# Altium schematic sheet TSE_switching_boardE3.SchDoc
size 420 x 297 mm; SheetNumber: 1; SheetTotal: 2
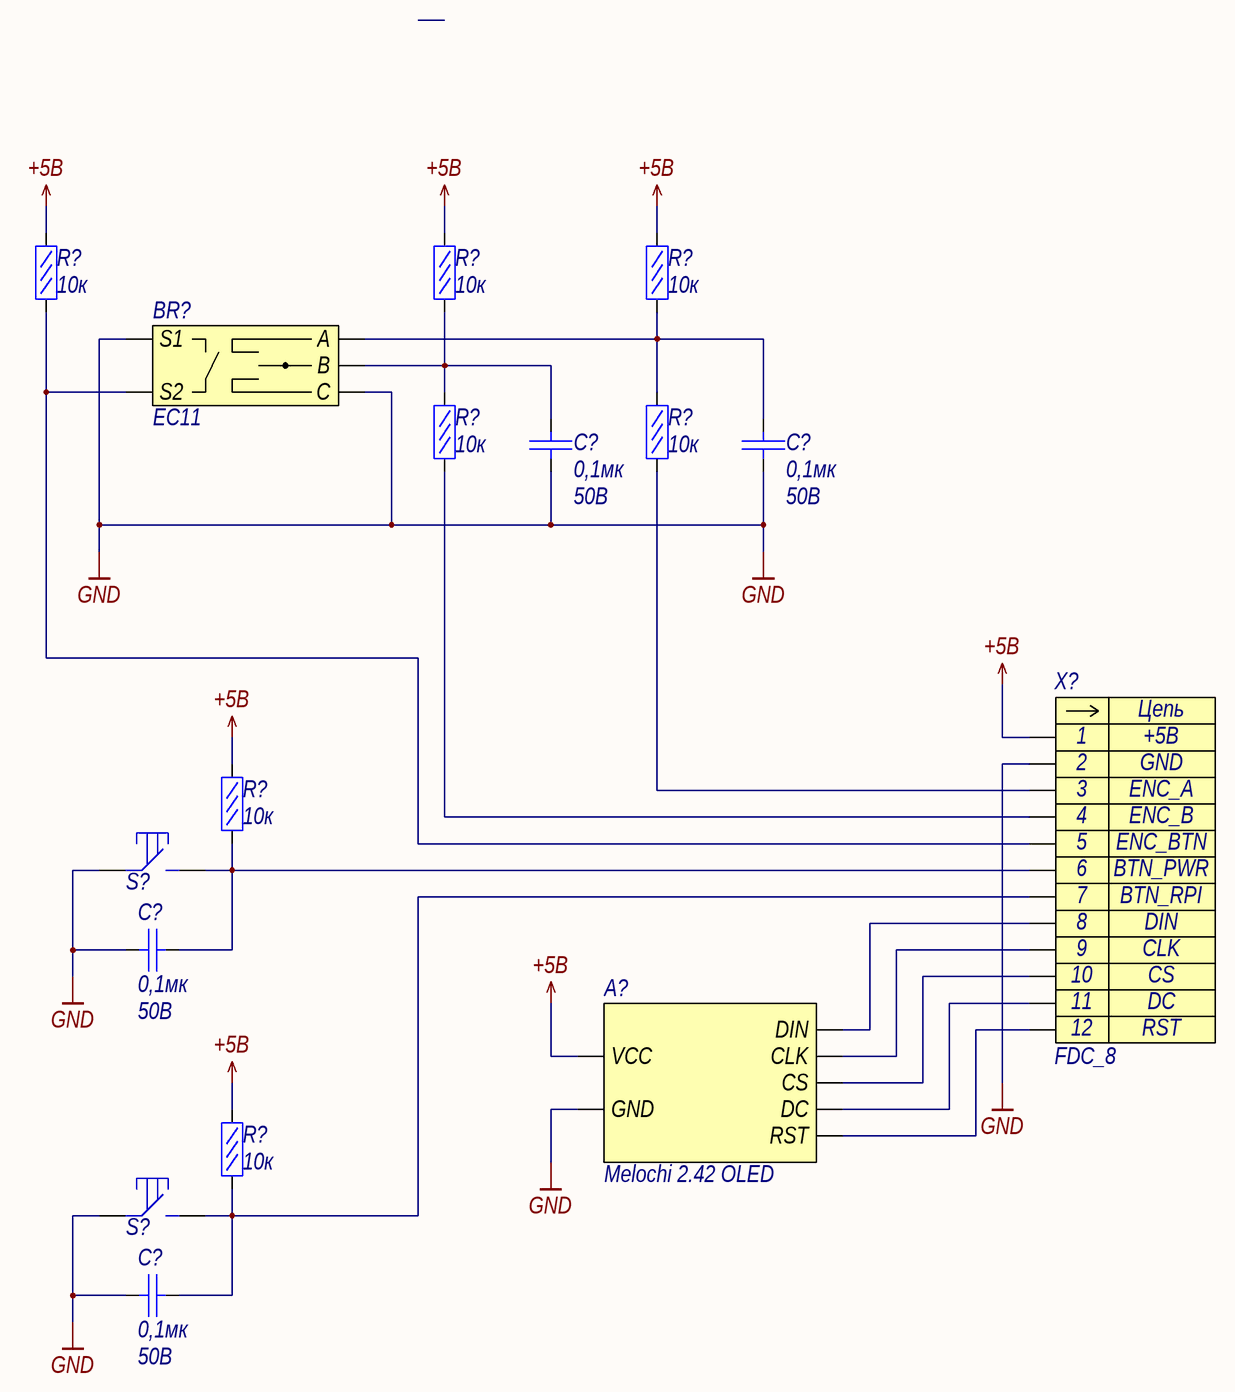
[diagram p0: TSE_switching_boardE3.SchDoc]

## Parts
(Parts that share a designator on the sheet are numbered #1, #2 ... from top to bottom, then left to right.)
A?  Melochi 2.42 OLED
BR?  EC11
C?#1  Voltage: 50В  [C0603]  (hidden comment: 0,1мк)
C?#2  Voltage: 50В  [C0603]  (hidden comment: 0,1мк)
C?#3  Voltage: 50В  [C0603]  (hidden comment: 0,1мк)
C?#4  Voltage: 50В  [C0603]  (hidden comment: 0,1мк)
R?#1  10к  [R0603]
R?#2  10к  [R0603]
R?#3  10к  [R0603]
R?#4  10к  [R0603]
R?#5  10к  [R0603]
R?#6  10к  [R0603]
R?#7  10к  [R0603]
S?#1  IT-1187  [it-1187]  (value not drawn)
S?#2  IT-1187  [it-1187]  (value not drawn)
X?  FDC_8  [FDC_12]

## Nets
+5В: A?.1(VCC) R?#1.2 R?#2.2 R?#3.2 R?#6.2 R?#7.2 X?.1
GND: A?.2(GND) BR?.1(S1) BR?.5(C) C?#1.1 C?#2.1 C?#3.1 C?#4.1 S?#1.1 S?#2.1 X?.2
NetA?_3: A?.3(DIN) X?.7
NetA?_4: A?.4(CLK) X?.7
NetA?_5: A?.5(CS) X?.7
NetA?_5: A?.5(DC) X?.7  [a separate net that carries the same name]
NetA?_5: A?.5(RST) X?.7  [a separate net that carries the same name]
NetBR?_2: BR?.2(S2) R?#1.1 X?.5
NetBR?_3: BR?.3(A) C?#2.2 R?#3.1 R?#5.2
NetBR?_4: BR?.4(B) C?#1.2 R?#2.1 R?#4.2
NetC?#3_2: C?#3.2 R?#6.1 S?#1.2 X?.6
NetC?#4_2: C?#4.2 R?#7.1 S?#2.2 X?.7
NetR?#4_1: R?#4.1 X?.4
NetR?#5_1: R?#5.1 X?.3

## Notes on the sheet
- Перв. примен.
- Справ. №
- Подп. и дата
- Инв. № дубл.
- Взам. инв. №
- Изм.
- Лист
- № докум.
- Подп.
- Дата
- Лит.
- Масса
- Масштаб
- Т.контр.
- Пров.
- Разраб.
- Листов
- Инв. № подл.
- Н.контр.
- Файл:
- Утв.
- Копировал
- Формат
- (in symbol FDC_12) Цепь; 8; 9; 10; 11; 12

## Library data of the parts
A? = Melochi 2.42 OLED: OLED дисплей 2.42 дюйма; Наименование: Melochi 2.42 OLED
BR? = EC11: Энкодер с кнопкой; Наименование: EC11
C?#1-C?#4 = CC0603JPX7R9BB104: Конденсатор кер. 0,1мкФ 50В; Manufacturer: Yageo; TKE: X7R; Name: CC0603JPX7R9BB104; Value: 0,1мк
R?#1-R?#7 = RC0603FR-0710KL: Резистор 10кОм 0,063Вт 1%; Manufacturer: YAGEO; Name: RC0603FR-0710KL; Tolerance: 1%; Value: 10к
S?#1 S?#2 = IT-1187: тактовая кнопка SMD; Name: IT-1187
X? = FDC_12: Разъем - 12 конт. прямая вилка на плату; Contact_1: +5В; Contact_2: GND; Contact_3: ENC_A; Contact_4: ENC_B; Contact_5: ENC_BTN; Contact_6: BTN_PWR; Contact_7: BTN_RPI; Contact_8: DIN; Contact_9: CLK; Contact_10: CS; Contact_11: DC; Contact_12: RST; Наименование: FDC_8